# EAGLE design E-P-020-R1.0 (EAGLE 7.2.0)
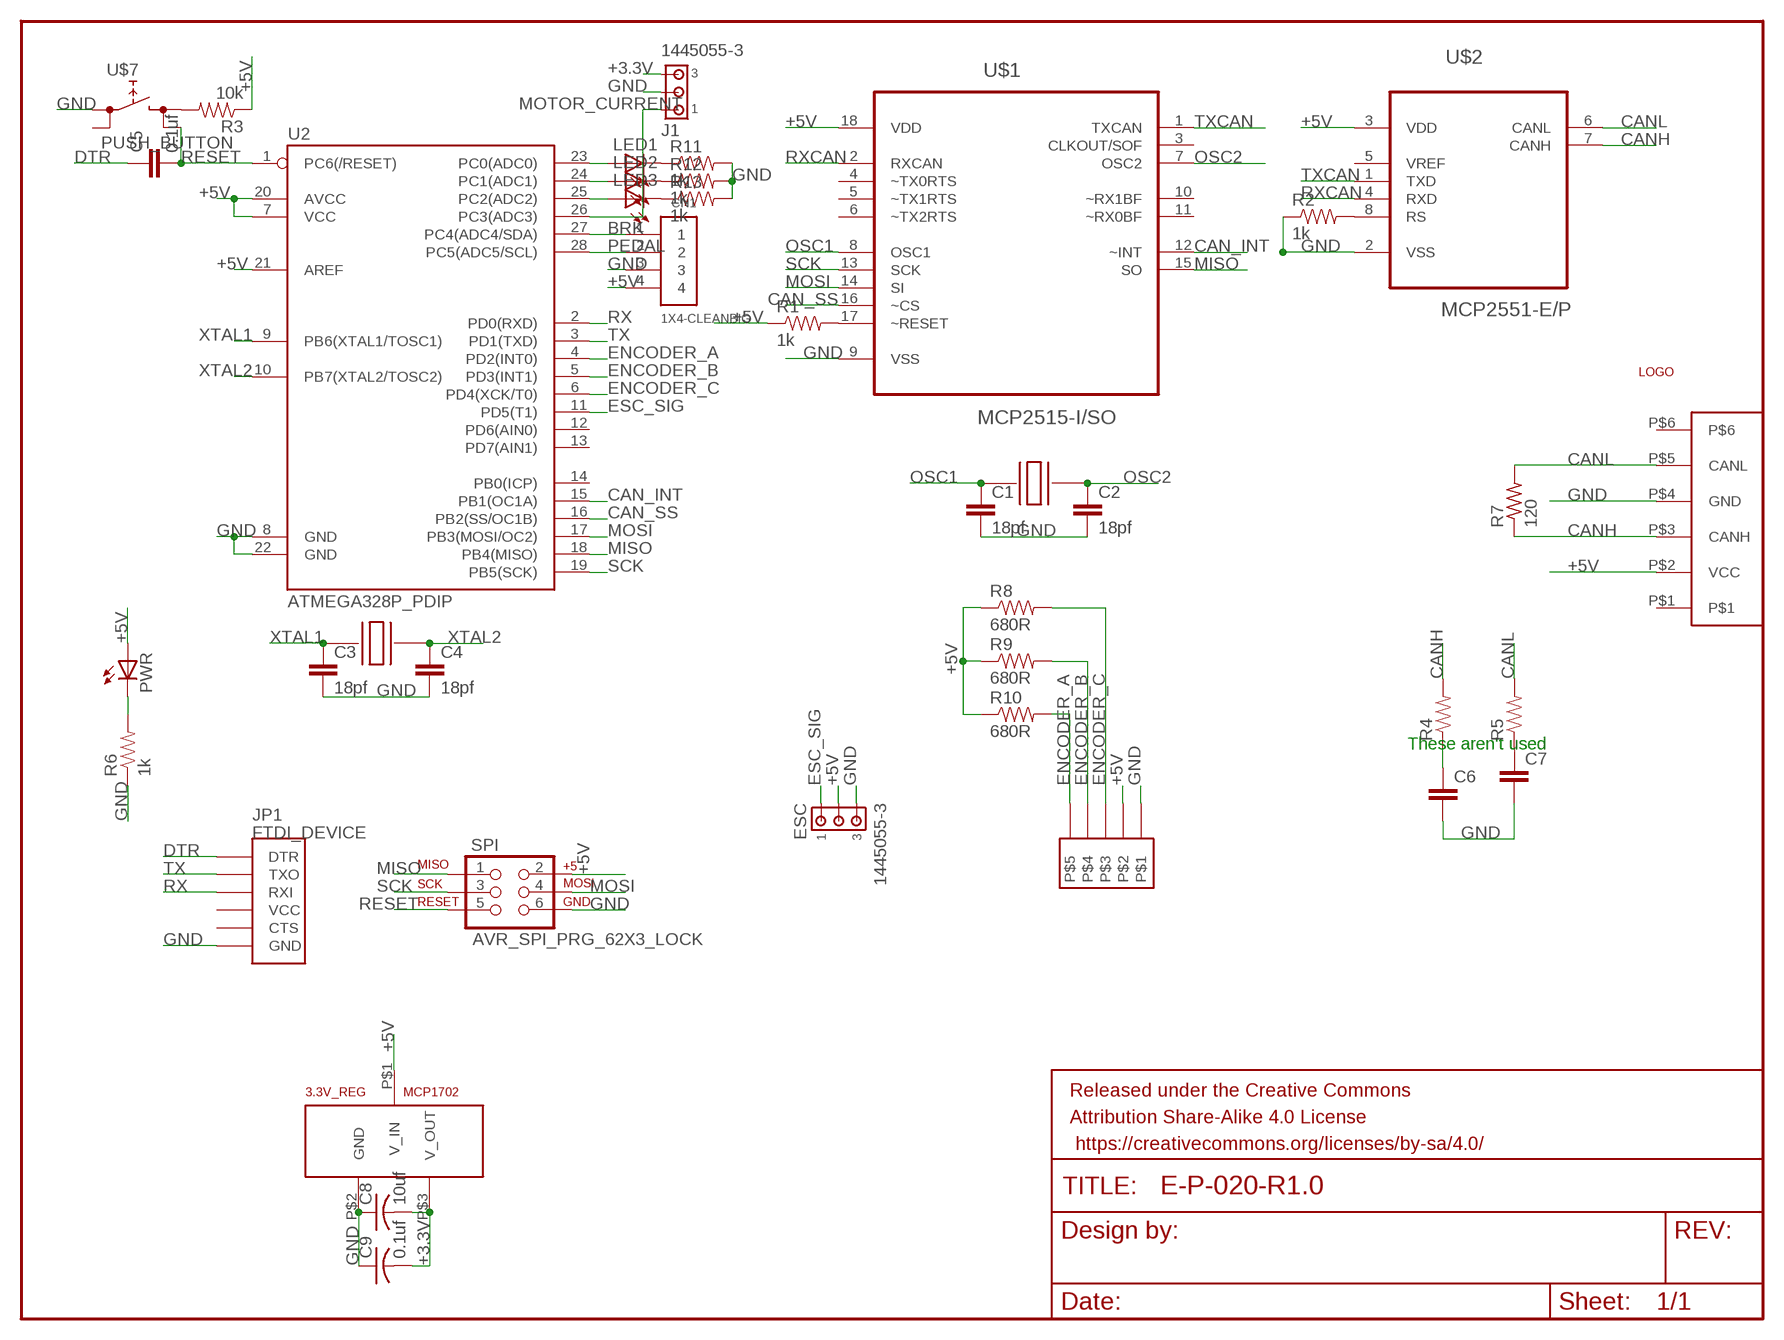
[diagram p0: schematic, sheet 1]

## Parts
3.3V_REG  MCP1702  [SOT-23A]
C1  18pf  CAP0805  [0805]
C2  18pf  CAP0805  [0805]
C3  18pf  CAP0805  [0805]
C4  18pf  CAP0805  [0805]
C5  0.1uf  CAP0805  [0805]
C6  CAP0805  [0805]
C7  CAP0805  [0805]
C8  10uf  C-USC0805  [C0805]
C9  0.1uf  C-USC0805  [C0805]
CAN-BUS  CAN_6P6C  [CAN_6P6C]
CN1  1X4-CLEANBIG  [1X04-CLEANBIG]
ENCODER  5_PIN_MICRO_MATE_N_LOCK  [5_PIN_MICRO_MATE_N_LOCK]
ESC  1445055-3  [1445055-3]
FRAME1  FRAME-LETTERNO_PACKAGE  [DUMMY]
J1  1445055-3  [1445055-3]
JP1  FTDI_DEVICE  [FTDI_DEVICE_SIDE]
LED1  LEDSMT1206  [1206]
LED2  LEDSMT1206  [1206]
LED3  LEDSMT1206  [1206]
PWR  LEDCHIPLED_1206  [CHIPLED_1206]
R1  1k  RESISTOR0805-RES  [0805]
R2  1k  RESISTOR0805-RES  [0805]
R3  10k  RESISTOR0805-RES  [0805]
R4  RESISTOR0805-RES  [0805]
R5  RESISTOR0805-RES  [0805]
R6  1k  RESISTOR0805-RES  [0805]
R7  120  R-US_M1206  [M1206]
R8  680R  0.75OHM-1/4W-1%(0805)  [0805]
R9  680R  0.75OHM-1/4W-1%(0805)  [0805]
R10  680R  0.75OHM-1/4W-1%(0805)  [0805]
R11  1k  RESISTOR0805-RES  [0805]
R12  1k  RESISTOR0805-RES  [0805]
R13  1k  RESISTOR0805-RES  [0805]
SPI  AVR_SPI_PRG_62X3_LOCK  [2X3_LOCK]
U2  ATMEGA328P_PDIP  [DIL28-3]
U$1  MCP2515-I/SO  [SOIC127P1034X264-18N]
U$2  MCP2551-E/P  [DIP254P762X432-8]
U$3  CRYSTAL  [7A_CRYSTAL]
U$4  CRYSTAL  [7A_CRYSTAL]
U$6  LOGO  [LOGO]
U$7  PUSH_BUTTON  [PUSHBUTTON]

## Nets
+3.3V: 3.3V_REG.P$3(V_OUT) C8.2 C9.2 J1.3
+5V: 3.3V_REG.P$1(V_IN) CAN-BUS.P$2(VCC) CN1.4 ENCODER.P$4 ESC.2 PWR.A R1.1 R3.1 R8.1 R9.1 R10.1 SPI.2 U2.7(VCC) U2.20(AVCC) U2.21(AREF) U$1.18(VDD) U$2.3(VDD)
BRK: CN1.1 U2.27(PC4(ADC4/SDA))
CAN_INT: U2.15(PB1(OC1A)) U$1.12(~INT)
CAN_SS: U2.16(PB2(SS/OC1B)) U$1.16(~CS)
CANH: CAN-BUS.P$3(CANH) R4.2 R7.1 U$2.7(CANH)
CANL: CAN-BUS.P$5(CANL) R5.2 R7.2 U$2.6(CANL)
DTR: C5.1 JP1.P$1(DTR)
ENCODER_A: ENCODER.P$1 R10.2 U2.4(PD2(INT0))
ENCODER_B: ENCODER.P$2 R9.2 U2.5(PD3(INT1))
ENCODER_C: ENCODER.P$3 R8.2 U2.6(PD4(XCK/T0))
ESC_SIG: ESC.1 U2.11(PD5(T1))
GND: 3.3V_REG.P$2(GND) C1.2 C2.2 C3.2 C4.2 C6.2 C7.2 C8.1 C9.1 CAN-BUS.P$4(GND) CN1.3 ENCODER.P$5 ESC.3 J1.2 JP1.P$6(GND) R2.1 R6.1 R11.2 R12.2 R13.2 SPI.6 U2.8(GND) U2.22(GND) U$1.9(VSS) U$2.2(VSS) U$7.L1(L)
MISO: SPI.1 U2.18(PB4(MISO)) U$1.15(SO)
MOSI: SPI.4 U2.17(PB3(MOSI/OC2)) U$1.14(SI)
MOTOR_CURRENT: J1.1 U2.26(PC3(ADC3))
N$1: R1.2 U$1.17(~RESET)
N$2: R2.2 U$2.8(RS)
N$3: C6.1 R4.1
N$4: R3.2 U$7.R1(R)
N$5: C7.1 R5.1
N$6: LED1.A U2.23(PC0(ADC0))
N$7: LED2.A U2.24(PC1(ADC1))
N$8: PWR.C R6.2
N$9: LED3.A U2.25(PC2(ADC2))
N$10: LED1.C R11.1
N$11: LED2.C R12.1
N$12: LED3.C R13.1
OSC1: C1.1 U$1.8(OSC1) U$3.P$2
OSC2: C2.1 U$1.7(OSC2) U$3.P$1
PEDAL: CN1.2 U2.28(PC5(ADC5/SCL))
RESET: C5.2 SPI.5 U2.1(PC6(/RESET)) U$7.R2(R)
RX: JP1.P$3(RXI) U2.2(PD0(RXD))
RXCAN: U$1.2(RXCAN) U$2.4(RXD)
SCK: SPI.3 U2.19(PB5(SCK)) U$1.13(SCK)
TX: JP1.P$2(TXO) U2.3(PD1(TXD))
TXCAN: U$1.1(TXCAN) U$2.1(TXD)
XTAL1: C3.1 U2.9(PB6(XTAL1/TOSC1)) U$4.P$2
XTAL2: C4.1 U2.10(PB7(XTAL2/TOSC2)) U$4.P$1
Unconnected: CAN-BUS.P$1 CAN-BUS.P$6 JP1.P$4(VCC) JP1.P$5(CTS) U2.12(PD6(AIN0)) U2.13(PD7(AIN1)) U2.14(PB0(ICP)) U$1.3(CLKOUT/SOF) U$1.4(~TX0RTS) U$1.5(~TX1RTS) U$1.6(~TX2RTS) U$1.10(~RX1BF) U$1.11(~RX0BF) U$2.5(VREF) U$7.L2(L)

## Notes on the sheet
- These aren't used

## Library data of the parts
3.3V_REG = mylibrary:MCP1702
C1-C7 = SparkFun-Capacitors:CAP: Capacitor Standard 0603 ceramic capacitor, and 0.1" leaded capacitor.
C8 C9 = adafruit:C-US: CAPACITOR, American symbol
CAN-BUS = Shell2015:CAN_6P6C: Digikey part: 553-2258-ND
CN1 = adafruit:1X4: 4-pin connector
ENCODER = Shell2015:5_PIN_MICRO_MATE_N_LOCK
ESC J1 = con-amp:1445055-3: Micro MATE-N-LOK Connectors grid 1.5 mm Source: ENG_CD_1445055_A.pdf
FRAME1 = SparkFun-Aesthetics:FRAME-LETTER: Schematic Frame Standard 8.5x11 US Letter frame; DESIGNER: Nobody; VERSION: v01
JP1 = SparkFun-Connectors:FTDI_DEVICE: Connector which mates to FTDI basic or FTDI cable.
LED1-LED3 = adafruit:LED: LED
PWR = E-P-099-R2.2:LED: LED
R1-R6 = SparkFun-Passives:RESISTOR: Resistor Basic schematic elements and footprints for 0603, 1206, and PTH resistors.
R7 = adafruit:R-US_: RESISTOR, American symbol
R8-R10 = SparkFun-Resistors:0.75OHM-1/4W-1%(0805): RES-08474; PROD_ID: RES-08474; VALUE: 0.75
R11-R13 = E-P-099-R2.2:RESISTOR: Resistor Basic schematic elements and footprints for 0603, 1206, and PTH resistors.
SPI = SparkFun-Connectors:AVR_SPI_PRG_6: AVR ISP 6 Pin This is the reduced ISP connector for AVR programming. Common on Arduino. This footprint will take up less PCB space and can be used with a 10-pin to 6-pin adapter such as SKU: BOB-08508 **Special note about "TEST_POINT" package. The stop mask is on the top side, so if you want your programming test points to be on the bottom of your board, make sure to place this package on the bottom side of the board. This also ensure that the orientation to program from the bottom side will be correct.
U2 = SparkFun-DigitalIC:ATMEGA328P_PDIP: uC used in the Arduino 32kb flash, 1k EEPROM, 2k SRAM This is the through-hole version of this chip.
U$1 = Microchip_By_element14_Batch_1:MCP2515-I/SO: CAN Controller; MPN: MCP2515-I/SO; OC_FARNELL: 1292239; OC_NEWARK: 29H7136; PACKAGE: SOIC-18; SUPPLIER: Microchip
U$2 = Microchip_By_element14_Batch_1:MCP2551-E/P: High-Speed CAN Transceiver; MPN: MCP2551-E/P; OC_FARNELL: 1439745; OC_NEWARK: 69K7603; PACKAGE: DIP-8; SUPPLIER: Microchip
U$3 U$4 = mylibrary:CRYSTAL
U$6 = Shell2015:LOGO
U$7 = E-P-099-R2.2:PUSH_BUTTON

## Board
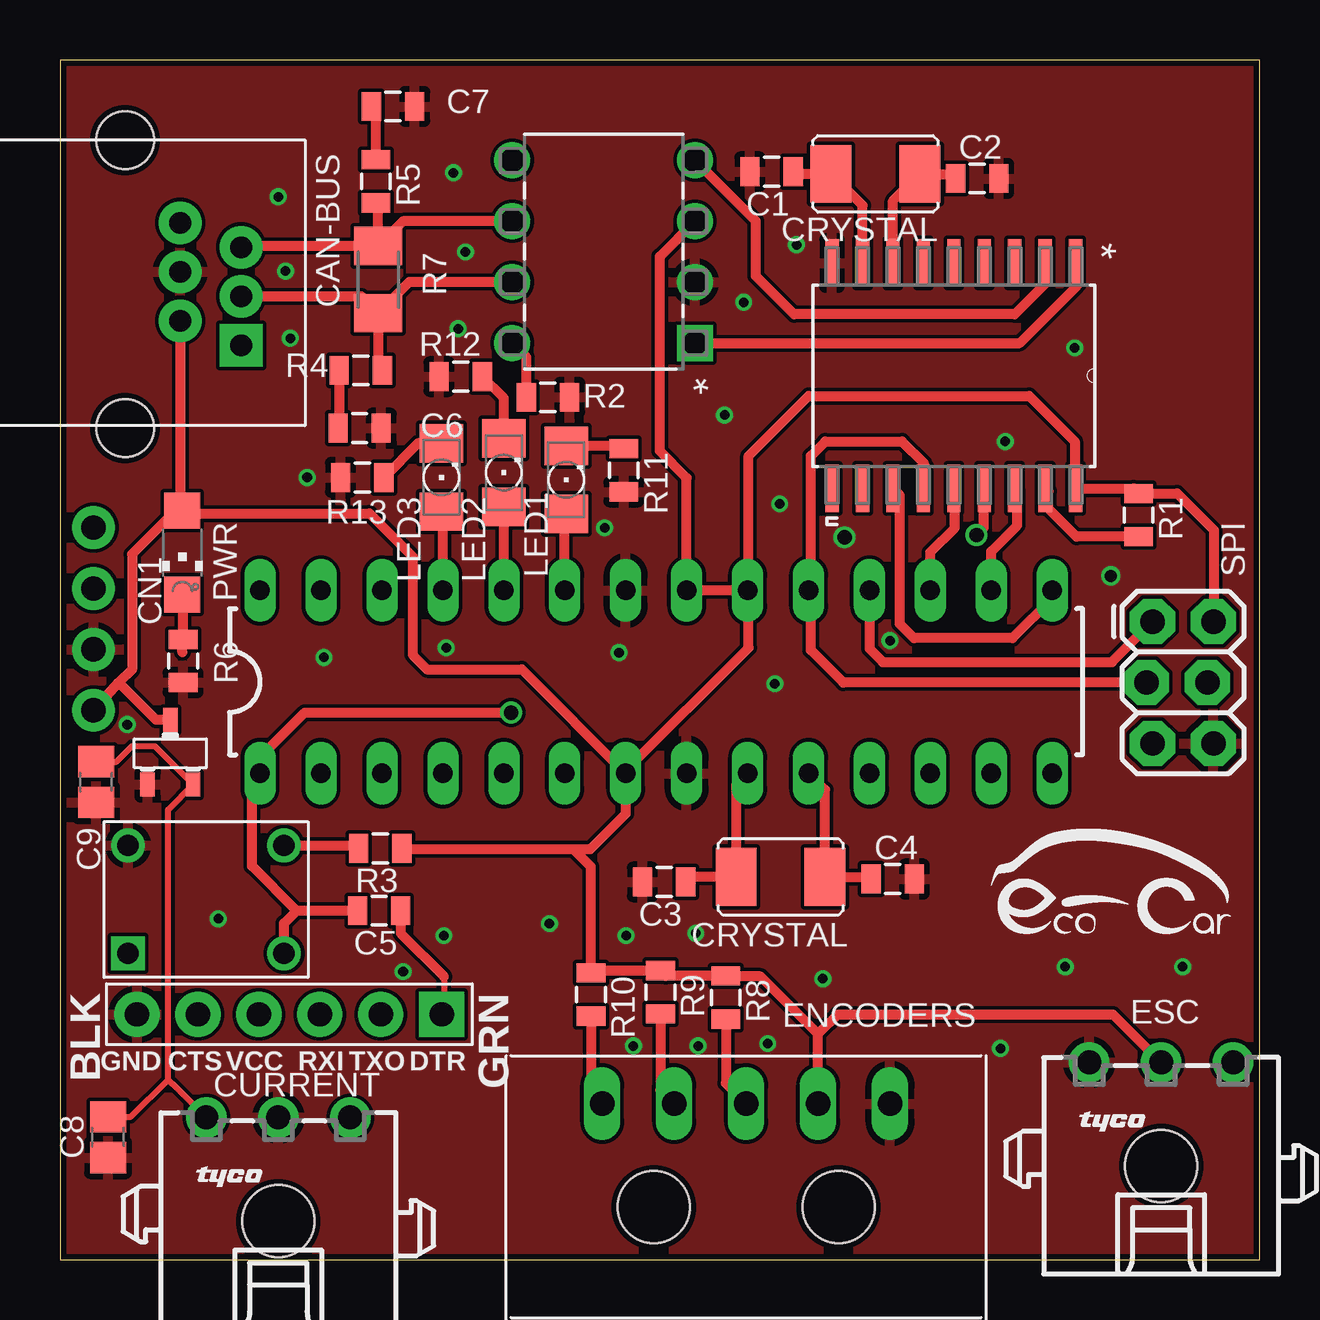
[diagram p1: board, top side]
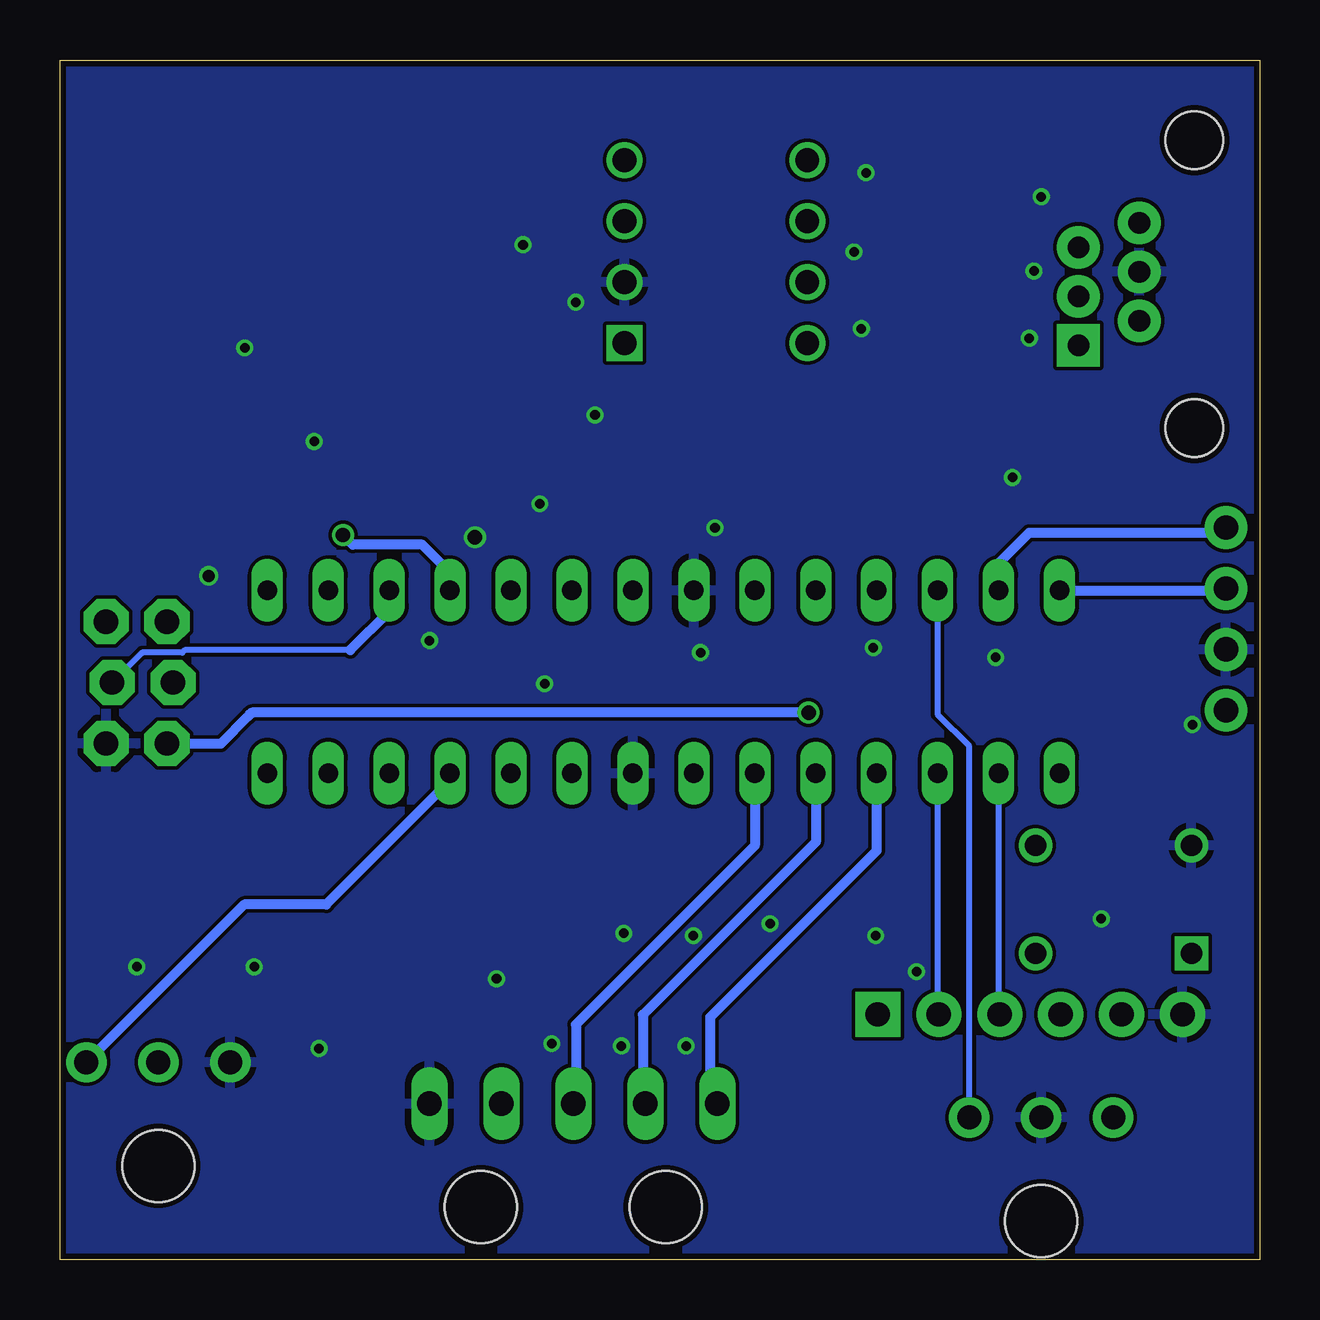
[diagram p2: board, bottom side, seen from below]

Size 50 x 50 mm. Coordinates in mm from the lower left corner, seen from the top.
Outline: 0,0 50,0 50,50 0,50 0,0
Copper layers (1*16): Top 0.035mm / dielectric 1.5mm / Bottom 0.035mm
Design rules "SeeedStudio_2layer_DRU_no_angle_20140221": minimum track width 6mil, minimum drill 12mil, track to track 6mil, track to pad 6mil, pad to pad 6mil, via to via 6mil, smd to smd 0mil, copper to edge 10mil, drill to drill 10mil, minimum pad ring 10mil, minimum via ring 6mil, stop-mask expansion 2mil, vias tented up to drill 100mil, thermal gap 10mil

### Footprints (pad centres in the part's own frame; a part is rotated, then mirrored left to right if it is on the bottom)
SOT-23A = smd 0.6 x 1: P$1 0,0; P$2 -0.95,-2.7; P$3 0.95,-2.7
0805 = smd 0.8 x 1.2: 1 -0.9,0; 2 0.9,0
C0805 = smd 1.3 x 1.5: 1 -0.85,0; 2 0.85,0
CAN_6P6C = drill 0.9 pad 1.778 square: P$1 4.08,0 | drill 0.9 pad 1.778: P$2 3.06,-2.54; P$3 2.04,0; P$4 1.02,-2.54; P$5 0,0; P$6 -1.02,-2.54 | hole 2.4: -4.47,-4.84; 7.53,-4.84
1X04-CLEANBIG = drill 1.016 pad 1.778: 1 -3.81,0; 2 -1.27,0; 3 1.27,0; 4 3.81,0
5_PIN_MICRO_MATE_N_LOCK = drill 1.02 long: P$1 -6,0; P$2 -3,0; P$3 0,0; P$4 3,0; P$5 6,0 | hole 3: -3.85,-4.32; 3.85,-4.32
1445055-3 = drill 1 pad 1.676: 1 3,4.32; 2 0,4.32; 3 -3,4.32 | hole 3: 0,0
FTDI_DEVICE_SIDE = drill 1.016 pad 1.88 square: P$1 -6.35,0 | drill 1.016 pad 1.88: P$2 -3.81,0; P$3 -1.27,0; P$4 1.27,0; P$5 3.81,0; P$6 6.35,0
1206 = smd 1.6 x 1.803: A -1.422,0; C 1.422,0
CHIPLED_1206 = smd 1.5 x 1.5: A 0,-1.75; C 0,1.75
M1206 = smd 1.6 x 2: 1 -1.4,0; 2 1.4,0
2X3_LOCK = drill 1.016 pad 1.88 octagon: 1 0,0; 2 0,2.54; 3 2.54,-0.254; 4 2.54,2.286; 5 5.08,0; 6 5.08,2.54
DIL28-3 = drill 0.813 long: 1 -16.51,-3.81; 2 -13.97,-3.81; 3 -11.43,-3.81; 4 -8.89,-3.81; 5 -6.35,-3.81; 6 -3.81,-3.81; 7 -1.27,-3.81; 8 1.27,-3.81; 9 3.81,-3.81; 10 6.35,-3.81; 11 8.89,-3.81; 12 11.43,-3.81; 13 13.97,-3.81; 14 16.51,-3.81; 15 16.51,3.81; 16 13.97,3.81; 17 11.43,3.81; 18 8.89,3.81; 19 6.35,3.81; 20 3.81,3.81; 21 1.27,3.81; 22 -1.27,3.81; 23 -3.81,3.81; 24 -6.35,3.81; 25 -8.89,3.81; 26 -11.43,3.81; 27 -13.97,3.81; 28 -16.51,3.81
SOIC127P1034X264-18N = smd 1.981 x 0.559: 1 -4.699,5.08; 2 -4.699,3.81; 3 -4.699,2.54; 4 -4.699,1.27; 5 -4.699,0; 6 -4.699,-1.27; 7 -4.699,-2.54; 8 -4.699,-3.81; 9 -4.699,-5.08; 10 4.699,-5.08; 11 4.699,-3.81; 12 4.699,-2.54; 13 4.699,-1.27; 14 4.699,0; 15 4.699,1.27; 16 4.699,2.54; 17 4.699,3.81; 18 4.699,5.08
DIP254P762X432-8 = drill 0.991 square: 1 -7.62,7.62 | drill 0.991: 2 -7.62,5.08; 3 -7.62,2.54; 4 -7.62,0; 5 0,0; 6 0,2.54; 7 0,5.08; 8 0,7.62
7A_CRYSTAL = smd 1.7 x 2.4: P$1 -1.85,0; P$2 1.85,0
PUSHBUTTON = drill 0.889: L1 0,4.5; R1 6.5,4.5; R2 6.5,0 | drill 0.889 square: L2 0,0

### Placement (x,y rotation side)
3.3V_REG  4.6,22.5 0 top
C1  29.66,45.34 180 top
C2  38.23,45.06 0 top
C3  25.18,15.74 180 top
C4  34.71,15.86 0 top
C5  13.3,14.54 180 top
C6  12.49,34.66 0 top
C7  13.88,48.06 0 top
C8  2,5.1 90 top
C9  1.5,19.9 90 top
CAN-BUS  7.55,42.19 270 top
CN1  1.4,26.7 270 top
ENCODER  28.6,6.5 0 top
ESC  45.9,3.9 0 top
FRAME1  -21.59,77.47 0 top  (outside the outline)
J1  9.1,1.6 0 top
JP1  9.56,10.22 180 top
LED1  21.1,32.5 90 top
LED2  18.5,32.8 90 top
LED3  15.9,32.6 90 top
PWR  5.1,29.47 180 top
R1  44.96,31.03 270 top
R2  20.34,35.94 180 top
R3  13.35,17.14 180 top
R4  12.54,37.06 0 top
R5  13.17,44.94 270 top
R6  5.13,24.95 90 top
R7  13.27,40.85 90 top
R8  27.75,10.92 270 top
R9  25.03,11.14 270 top
R10  22.13,11.05 270 top
R11  23.5,32.9 270 top
R12  16.7,36.8 180 top
R13  12.6,32.6 180 top
SPI  45.54,26.59 270 top
U2  24.85,24.08 0 top
U$1  37.26,36.84 270 top
U$2  18.85,45.82 180 top
U$3  33.99,45.25 180 top
U$4  30.04,15.95 180 top
U$6  44.2,15.35 0 top
U$7  2.84,12.76 0 top

### Tracks (layer width: path | path; a pad name or v marks a point on that pad's centre or on a via)
+3.3V
  Top 0.254: J1.3 4.7,7.32 4.68,7.32 4.5,7.5 | 4.5,7.5 4.5,18.75 3.3V_REG.P$3 3.95,21.4 3,21.4 2.35,20.75 C9.2 | C8.2 2.95,5.95 4.5,7.5
+5V
  Top 0.406: 21.4,17.1 22.1,17.1 23.58,18.58 U2.7 | 21.4,17.1 14.29,17.1 R3.1 | 28.7,27.85 28.7,25.5 23.58,20.38 U2.7 | 28.7,27.85 U2.20 U2.21 26.12,32.58 25,33.7 25,41.81 U$2.3 | CAN-BUS.P$2 5.01,31.31 PWR.A 5.22,31.1 | 28.7,27.85 28.7,33.5 31.2,36 40.4,36 42.3,34.1 42.3,32.18 U$1.18 44.75,32.14 R1.1 46.57,31.93 48.1,30.4 48.1,26.61 SPI.2 | ENCODER.P$4 31.6,9.4 | 31.6,9.4 29.2,11.8 27.77,11.8 R8.1 25.25,11.82 R9.1 22.22,12.04 R10.1 22.13,16.37 21.4,17.1 | ESC.2 45.88,8.22 43.9,10.2 32.4,10.2 31.6,9.4 | 5.22,31.1 4.7,31.1 3,29.4 3,24.59 2.46,24.05 | 2.46,24.05 CN1.4 | 3.3V_REG.P$1 4,22.5 2.46,24.05 | 5.22,31.1 12.9,31.1 14.7,29.3 14.7,25.2 15.3,24.6 19.25,24.6 U2.7
BRK
  Bottom 0.406: U2.27 10.88,29.02 9.6,30.3 1.09,30.3 CN1.1
CAN_INT
  Top 0.406: U2.15 41.36,27.56 39.7,25.9 35.6,25.9 35,26.5 35,31.86 U$1.12
CAN_SS
  Top 0.406: U2.16 38.82,29.52 39.9,30.6 39.9,32.04 U$1.16
CANH
  Top 0.406: U$2.7 14.56,40.74 R7.1 | R7.1 13.27,37.23 R4.2 | CAN-BUS.P$3 12.57,40.15 R7.1
CANL
  Top 0.406: R7.2 13.27,43.94 R5.2 | R7.2 7.61,42.25 CAN-BUS.P$5 | U$2.6 14.3,43.28 R7.2
DTR
  Top 0.254: 16,11.8 16,10.31 JP1.P$1
  Top 0.406: C5.1 14.2,13.6 16,11.8
ENCODER_A
  Top 0.406: R10.2 22.13,6.97 ENCODER.P$1
  Bottom 0.406: U2.4 15.96,17.04 22.9,10.1 22.9,6.8 ENCODER.P$1
ENCODER_B
  Top 0.406: R9.2 25.03,7.07 ENCODER.P$2
  Bottom 0.406: U2.5 18.5,17.4 25.7,10.2 25.7,6.6 ENCODER.P$2
ENCODER_C
  Top 0.406: R8.2 27.75,7.35 ENCODER.P$3
  Bottom 0.406: U2.6 21.04,17.26 28.5,9.8 28.5,6.6 ENCODER.P$3
ESC_SIG
  Bottom 0.406: U2.11 33.74,19.96 38.9,14.8 42.32,14.8 ESC.1
GND  (via drill 0.4, 0.5, 0.6)
  other vias: 43.8,28.5 32.7,30.1 14.3,12 16,13.5 6.6,14.2 20.4,14 23.6,13.5 26.5,13.6 26.6,8.9 23.9,8.9 29.5,9 31.8,11.7 39.2,8.8 41.9,12.2 46.8,12.2 34.6,25.8 9.4,41.2 2.8,22.3 29.8,24 23.3,25.3 16.1,25.5 11,25.1 10.3,32.6 22.7,30.5 27.7,35.2 30,31.5 39.4,34.1 42.3,38 28.5,39.9 30.7,42.3 16.6,38.8 16.9,42 16.4,45.3 9.1,44.3 9.6,38.4
  pour Bottom: 59,56.5 59,-1.5 -9.2,-1.5 -9.2,56.4
  pour Top: 60.1,57 60.1,-1 -11.7,-1.7 -11.5,56.4
  pour Top: 60.1,57 60.1,-1 -11.7,-1.7 -11.5,56.4
MISO  (via drill 0.6)
  Top 0.406: U2.18 33.74,25.46 34.3,24.9 43.85,24.9 SPI.1 | v38.2,30.2 38.5,30.5 38.5,32.11 U$1.15
  Bottom 0.406: U2.18 33.74,28.64 34.9,29.8 37.8,29.8 v38.2,30.2
MOSI
  Top 0.406: U2.17 36.28,29.48 37.3,30.5 37.3,32.1 U$1.14
  Bottom 0.254: 37.9,25.4 44.8,25.4 44.9,25.3 46.58,25.3 SPI.4
  Bottom 0.406: U2.17 36.28,27.02 37.9,25.4
MOTOR_CURRENT
  Bottom 0.254: U2.26 13.42,22.72 12.1,21.4 J1.1
N$1
  Top 0.406: R1.2 42.37,30.13 41.2,31.3 41.2,32.01 U$1.17
N$2
  Top 0.406: R2.2 19.44,37.61 U$2.8
N$3
  Top 0.406: R4.1 11.64,34.71 C6.1
N$4
  Top 0.406: U$7.R1 12.33,17.26 R3.2
N$5
  Top 0.406: R5.1 13.17,47.87 C7.1
N$6
  Top 0.406: U2.23 21.04,31.02 LED1.A
N$7
  Top 0.406: U2.24 LED2.A
N$8
  Top 0.406: 5.1,25.32 R6.2 5.13,27.69 PWR.C
N$9
  Top 0.406: U2.25 15.96,31.12 LED3.A
N$10
  Top 0.406: LED1.C 23.38,33.92 R11.1
N$11
  Top 0.406: LED2.C 18.5,35.9 R12.1
N$12
  Top 0.406: LED3.C 14.92,34.02 R13.1
OSC1
  Top 0.406: U$1.8 33.45,43.94 U$3.P$2 30.65,45.25 C1.1
OSC2
  Top 0.406: U$1.7 34.72,44.13 U$3.P$1 37.14,45.25 C2.1
PEDAL
  Bottom 0.406: U2.28 1.22,27.89 CN1.2
RESET  (via drill 0.6)
  Top 0.406: C5.2 9.86,14.54 | 9.86,14.54 8,16.4 8,19.93 U2.1 8.34,20.94 10.2,22.8 v18.8,22.8 | U$7.R2 9.34,14.02 9.86,14.54
  Bottom 0.406: SPI.5 43.29,21.51 42.15,22.65 42,22.8 v18.8,22.8
RX
  Bottom 0.254: U2.2 10.88,10.27 JP1.P$3
RXCAN
  Top 0.406: U$1.2 41.07,40.67 39.8,39.4 30.6,39.4 29,41 29,43.29 U$2.4
SCK
  Top 0.406: SPI.3 32.65,24.05 31.3,25.4 31.3,27.79 | 31.3,27.79 U2.19 | 31.3,27.79 31.3,33.5 31.9,34.1 35.1,34.1 36,33.2 36,32.15 U$1.13
TX
  Bottom 0.254: U2.3 13.42,10.27 JP1.P$2
TXCAN
  Top 0.406: U$2.1 40,38.2 42.4,40.6 42.4,41.48 U$1.1
XTAL1
  Top 0.406: U2.9 28.19,19.8 U$4.P$2 26.29,15.95 C3.1
XTAL2
  Top 0.406: U2.10 31.89,19.58 U$4.P$1 33.72,15.95 C4.1

### Text on the board
tPlace: ENCODERS | CURRENT